# EAGLE design ursus-flow (EAGLE 7.7.0)
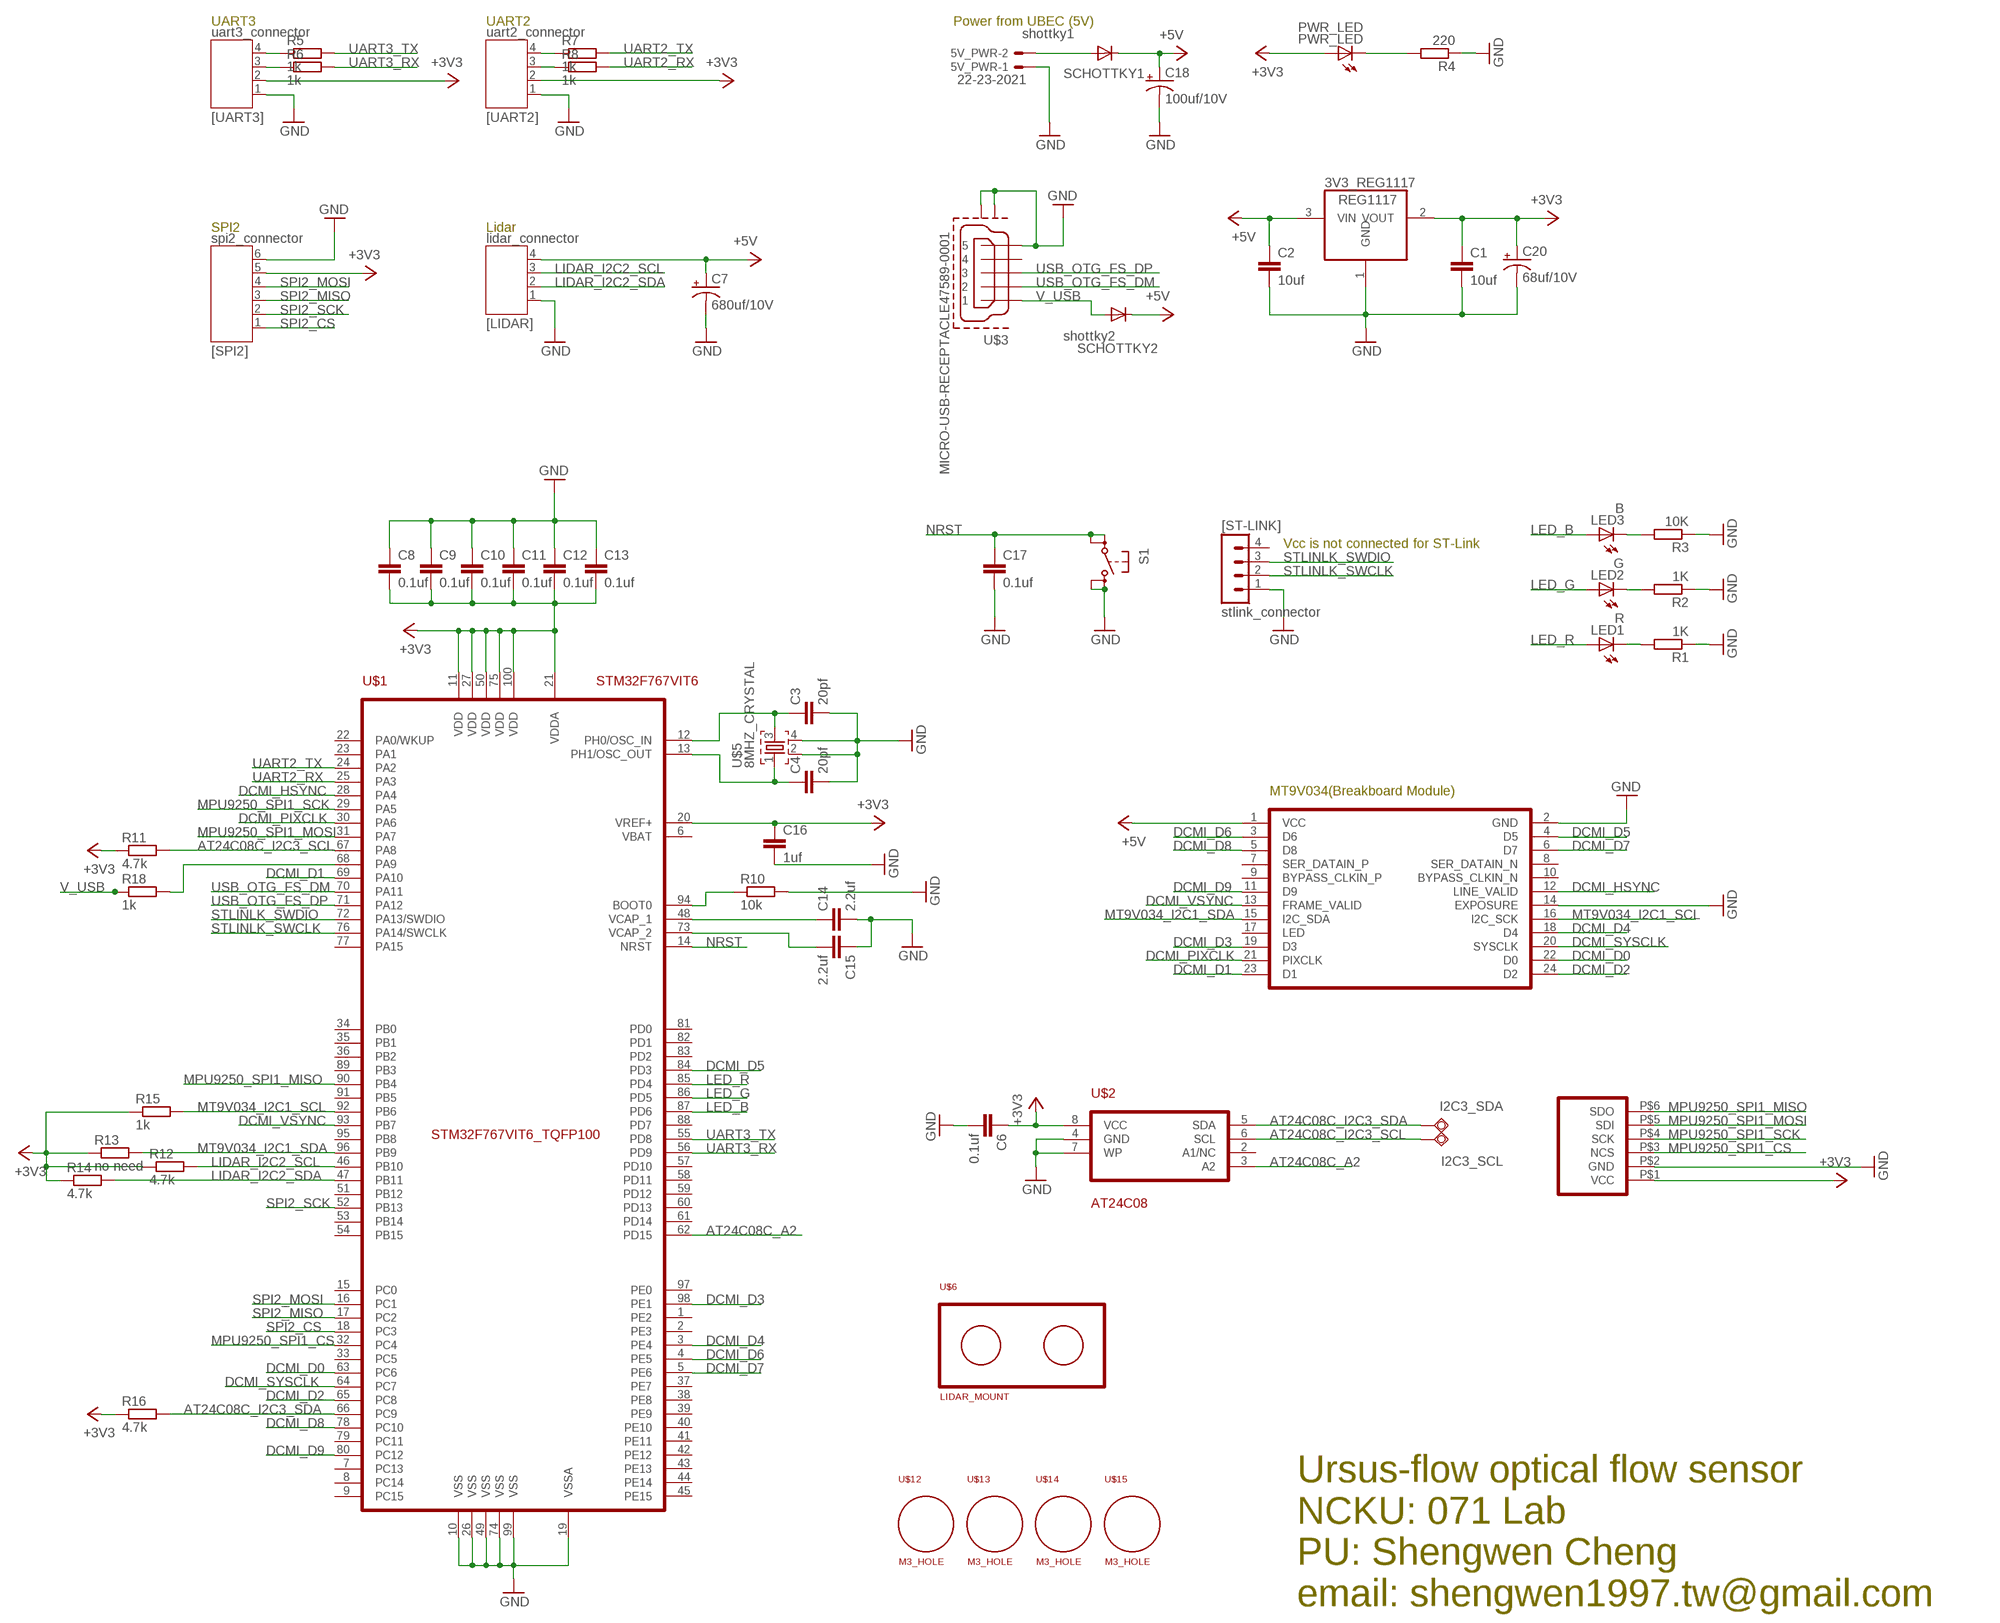
[diagram p0: schematic, sheet 1]

## Parts
3V3_REG1117  REG1117  [SOT223]
5V_PWR  22-23-2021  [22-23-2021]
[LIDAR]  lidar_connector  JST-PH4  [JST-PH4]
[SPI2]  spi2_connector  JST-PH6  [JST-PH6]
[ST-LINK]  stlink_connector  MA04-1  [MA04-1]
[UART2]  uart2_connector  JST-PH4  [JST-PH4]
[UART3]  uart3_connector  JST-PH4  [JST-PH4]
C1  10uf  C-EUC0805K  [C0805K]
C2  10uf  C-EUC0805K  [C0805K]
C3  20pf  C-EUC0805  [C0805]
C4  20pf  C-EUC0805  [C0805]
C6  0.1uf  C-EUC0805  [C0805]
C7  680uf/10V  CPOL-USD/7343-31W  [D/7343-31W]
C8  0.1uf  C-EUC0805  [C0805]
C9  0.1uf  C-EUC0805  [C0805]
C10  0.1uf  C-EUC0805  [C0805]
C11  0.1uf  C-EUC0805  [C0805]
C12  0.1uf  C-EUC0805  [C0805]
C13  0.1uf  C-EUC0805  [C0805]
C14  2.2uf  C-EUC0805  [C0805]
C15  2.2uf  C-EUC0805  [C0805]
C16  1uf  C-EUC0805  [C0805]
C17  0.1uf  C-EUC0805  [C0805]
C18  100uf/10V  CPOL-USC/6032-28R  [C/6032-28R]
C20  68uf/10V  CPOL-USB/3528-21W  [B/3528-21W]
I2C3_SCL  TPSQTP20SQ  [TP20SQ]
I2C3_SDA  TPSQTP20SQ  [TP20SQ]
LED1  R  LEDSML0805  [SML0805]
LED2  G  LEDSML0805  [SML0805]
LED3  B  LEDSML0805  [SML0805]
PWR_LED  PWR_LED  LEDSML0805  [SML0805]
R1  1K  R-EU_R0805W  [R0805W]
R2  1K  R-EU_R0805W  [R0805W]
R3  10K  R-EU_R0805W  [R0805W]
R4  220  R-EU_R0805W  [R0805W]
R5  1k  R-EU_M0805  [M0805]
R6  1k  R-EU_M0805  [M0805]
R7  1k  R-EU_M0805  [M0805]
R8  1k  R-EU_M0805  [M0805]
R10  10k  R-EU_R0805W  [R0805W]
R11  4.7k  R-EU_R0805W  [R0805W]
R12  4.7k  R-EU_R0805W  [R0805W]
R13  no need  R-EU_R0805W  [R0805W]
R14  4.7k  R-EU_R0805W  [R0805W]
R15  1k  R-EU_R0805W  [R0805W]
R16  4.7k  R-EU_R0805W  [R0805W]
R18  1k  R-EU_R0805W  [R0805W]
S1  EVQPSL/Q  [EVQPSL/Q]
SCHOTTKY1  shottky1  DIODE-SOD323-W  [SOD323-W]
SCHOTTKY2  shottky2  DIODE-SOD323-W  [SOD323-W]
U$1  STM32F767VIT6  [STM32F767VIT6]
U$2  AT24C08  [SO8]
U$3  MICRO-USB-RECEPTACLE47589-0001  [47589-0001]
U$4  MT9V034_MODULE  [MA12-2]
U$5  8MHZ_CRYSTAL  [8MHZ_CRYSTAL]
U$6  LIDAR_MOUNT  [LIDAR_MOUNT]
U$11  MPU9250_BREAKOUT  [MPU9250_BREAKOUT]
U$12  M3_HOLE  [M3_HOLE]
U$13  M3_HOLE  [M3_HOLE]
U$14  M3_HOLE  [M3_HOLE]
U$15  M3_HOLE  [M3_HOLE]

## Nets
+3V3: 3V3_REG1117.2(VOUT) [SPI2].5 [UART2].2 [UART3].2 C1.1 C6.1 C8.2 C9.2 C10.2 C11.2 C12.2 C13.2 C16.1 C20.+ PWR_LED.A R11.1 R12.1 R13.1 R14.1 R15.1 R16.1 U$1.11(VDD) U$1.20(VREF+) U$1.21(VDDA) U$1.27(VDD) U$1.50(VDD) U$1.75(VDD) U$1.100(VDD) U$2.8(VCC) U$11.P$1(VCC)
+5V: 3V3_REG1117.3(VIN) [LIDAR].4 C2.1 C7.+ C18.+ SCHOTTKY1.C SCHOTTKY2.C U$4.1(VCC)
AT24C08C_A2: U$1.62(PD15) U$2.3(A2)
AT24C08C_I2C3_SCL: I2C3_SCL.TP R11.2 U$1.67(PA8) U$2.6(SCL)
AT24C08C_I2C3_SDA: I2C3_SDA.TP R16.2 U$1.66(PC9) U$2.5(SDA)
DCMI_D0: U$1.63(PC6) U$4.22(D0)
DCMI_D1: U$1.69(PA10) U$4.23(D1)
DCMI_D2: U$1.65(PC8) U$4.24(D2)
DCMI_D3: U$1.98(PE1) U$4.19(D3)
DCMI_D4: U$1.3(PE4) U$4.18(D4)
DCMI_D5: U$1.84(PD3) U$4.4(D5)
DCMI_D6: U$1.4(PE5) U$4.3(D6)
DCMI_D7: U$1.5(PE6) U$4.6(D7)
DCMI_D8: U$1.78(PC10) U$4.5(D8)
DCMI_D9: U$1.80(PC12) U$4.11(D9)
DCMI_HSYNC: U$1.28(PA4) U$4.12(LINE_VALID)
DCMI_PIXCLK: U$1.30(PA6) U$4.21(PIXCLK)
DCMI_SYSCLK: U$1.64(PC7) U$4.20(SYSCLK)
DCMI_VSYNC: U$1.93(PB7) U$4.13(FRAME_VALID)
GND: 3V3_REG1117.1(GND) 5V_PWR.1 [LIDAR].1 [SPI2].6 [ST-LINK].1 [UART2].1 [UART3].1 C1.2 C2.2 C3.2 C4.2 C6.2 C7.- C8.1 C9.1 C10.1 C11.1 C12.1 C13.1 C14.2 C15.1 C16.2 C17.2 C18.- C20.- R1.1 R2.1 R3.1 R4.1 R10.2 S1.B1(S1) S1.B(S) U$1.10(VSS) U$1.19(VSSA) U$1.26(VSS) U$1.49(VSS) U$1.74(VSS) U$1.99(VSS) U$2.4(GND) U$2.7(WP) U$3.5 U$3.CASING1(GND1) U$3.CASING2(GND2) U$4.2(GND) U$4.14(EXPOSURE) U$5.2 U$5.4 U$11.P$2(GND)
LED_B: LED3.A U$1.87(PD6)
LED_G: LED2.A U$1.86(PD5)
LED_R: LED1.A U$1.85(PD4)
LIDAR_I2C2_SCL: [LIDAR].3 R12.2 U$1.46(PB10)
LIDAR_I2C2_SDA: [LIDAR].2 R14.2 U$1.47(PB11)
MPU9250_SPI1_CS: U$1.32(PC4) U$11.P$3(NCS)
MPU9250_SPI1_MISO: U$1.90(PB4) U$11.P$6(SDO)
MPU9250_SPI1_MOSI: U$1.31(PA7) U$11.P$5(SDI)
MPU9250_SPI1_SCK: U$1.29(PA5) U$11.P$4(SCK)
MT9V034_I2C1_SCL: R15.2 U$1.92(PB6) U$4.16(I2C_SCK)
MT9V034_I2C1_SDA: R13.2 U$1.96(PB9) U$4.15(I2C_SDA)
N$1: LED1.C R1.2
N$2: LED2.C R2.2
N$3: LED3.C R3.2
N$4: PWR_LED.C R4.2
N$6: 5V_PWR.2 SCHOTTKY1.A
N$7: C3.1 U$1.12(PH0/OSC_IN) U$5.3
N$8: [UART3].4 R5.1
N$9: [UART3].3 R6.1
N$10: [UART2].4 R7.1
N$11: [UART2].3 R8.1
N$12: C4.1 U$1.13(PH1/OSC_OUT) U$5.1
N$13: C14.1 U$1.48(VCAP_1)
N$14: C15.2 U$1.73(VCAP_2)
N$15: R10.1 U$1.94(BOOT0)
N$19: R18.2 U$1.68(PA9)
NRST: C17.1 S1.A1(P1) S1.A(P) U$1.14(NRST)
SPI2_CS: [SPI2].1 U$1.18(PC3)
SPI2_MISO: [SPI2].3 U$1.17(PC2)
SPI2_MOSI: [SPI2].4 U$1.16(PC1)
SPI2_SCK: [SPI2].2 U$1.52(PB13)
STLINLK_SWCLK: [ST-LINK].2 U$1.76(PA14/SWCLK)
STLINLK_SWDIO: [ST-LINK].3 U$1.72(PA13/SWDIO)
UART2_RX: R8.2 U$1.25(PA3)
UART2_TX: R7.2 U$1.24(PA2)
UART3_RX: R6.2 U$1.56(PD9)
UART3_TX: R5.2 U$1.55(PD8)
USB_OTG_FS_DM: U$1.70(PA11) U$3.2
USB_OTG_FS_DP: U$1.71(PA12) U$3.3
V_USB: R18.1 SCHOTTKY2.A U$3.1
Unconnected: [ST-LINK].4 U$1.1(PE2) U$1.2(PE3) U$1.6(VBAT) U$1.7(PC13) U$1.8(PC14) U$1.9(PC15) U$1.15(PC0) U$1.22(PA0/WKUP) U$1.23(PA1) U$1.33(PC5) U$1.34(PB0) U$1.35(PB1) U$1.36(PB2) U$1.37(PE7) U$1.38(PE8) U$1.39(PE9) U$1.40(PE10) U$1.41(PE11) U$1.42(PE12) U$1.43(PE13) U$1.44(PE14) U$1.45(PE15) U$1.51(PB12) U$1.53(PB14) U$1.54(PB15) U$1.57(PD10) U$1.58(PD11) U$1.59(PD12) U$1.60(PD13) U$1.61(PD14) U$1.77(PA15) U$1.79(PC11) U$1.81(PD0) U$1.82(PD1) U$1.83(PD2) U$1.88(PD7) U$1.89(PB3) U$1.91(PB5) U$1.95(PB8) U$1.97(PE0) U$2.2(A1/NC) U$3.4 U$4.7(SER_DATAIN_P) U$4.8(SER_DATAIN_N) U$4.9(BYPASS_CLKIN_P) U$4.10(BYPASS_CLKIN_N) U$4.17(LED)

## Notes on the sheet
- UART3 | UART2 | Power from UBEC (5V)
- SPI2 | Lidar
- Vcc is not connected for ST-Link
- MT9V034(Breakboard Module)
- Ursus-flow optical flow sensor
  NCKU: 071 Lab
  PU: Shengwen Cheng
  email: shengwen1997.tw@gmail.com

## Library data of the parts
3V3_REG1117 = burr-brown:REG1117: 800mA and 1A Low Dropout (LDO) Positive Regulator 1.8V, 2.5V, 2.85V, 3.3V, 5V, and Adj; MPN: REG1117; OC_FARNELL: 1097566; OC_NEWARK: 14P6981
5V_PWR = con-molex:22-23-2021: .100" (2.54mm) Center Header - 2 Pin; MF: MOLEX; MPN: 22-23-2021; OC_FARNELL: 1462926; OC_NEWARK: 25C3832
[LIDAR] [UART2] [UART3] = jst-ph:JST-PH4
[SPI2] = jst-ph:JST-PH6
[ST-LINK] = con-lstb:MA04-1: PIN HEADER; OC_FARNELL: unknown; OC_NEWARK: unknown
C1-C4 C6 C8-C17 = rcl:C-EU: CAPACITOR, European symbol
C7 C18 C20 = rcl:CPOL-US: POLARIZED CAPACITOR, American symbol
I2C3_SCL I2C3_SDA = testpad:TPSQ: Test pad
LED1-LED3 PWR_LED = led:LED: LED OSRAM: - CHIPLED LG R971, LG N971, LY N971, LG Q971, LY Q971, LO R971, LY R971 LH N974, LH R974 LS Q976, LO Q976, LY Q976 LO Q996 - Hyper CHIPLED LW Q18S LB Q993, LB Q99A, LB R99A - SideLED LS A670, LO A670, LY A670, LG A670, LP A670 LB A673, LV A673, LT A673, LW A673 LH A674 LY A675 LS A676, LA A676, LO A676, LY A676, LW A676 LS A679, LY A679, LG A679 - Hyper Micro SIDELED® LS Y876, LA Y876, LO Y876, LY Y876 LT Y87S - SmartLED LW L88C, LW L88S LB L89C, LB L89S, LG L890 LS L89K, LO L89K, LY L89K LS L896, LA L896, LO L896, LY L896 - TOPLED LS T670, LO T670, LY T670, LG T670, LP T670 LSG T670, LSP T670, LSY T670, LOP T670, LYG T670 LG T671, LOG T671, LSG T671 LB T673, LV T673, LT T673, LW T673 LH T674 LS T676, LA T676, LO T676, LY T676, LB T676, LH T676, LSB T676, LW T676 LB T67C, LV T67C, LT T67C, LS T67K, LO T67K, LY T67K, LW E67C LS E67B, LA E67B, LO E67B, LY E67B, LB E67C, LV E67C, LT E67C LW T67C LS T679, LY T679, LG T679 LS T770, LO T770, LY T770, LG T770, LP T770 LB T773, LV T773, LT T773, LW T773 LH T774 LS E675, LA E675, LY E675, LS T675 LS T776, LA T776, LO T776, LY T776, LB T776 LHGB T686 LT T68C, LB T68C - Hyper Mini TOPLED® LB M676 - Mini TOPLED Santana® LG M470 LS M47K, LO M47K, LY M47K Source: http://www.osram.convergy.de LUXEON: - LUMILED® LXK2-PW12-R00, LXK2-PW12-S00, LXK2-PW14-U00, LXK2-PW14-V00 LXK2-PM12-R00, LXK2-PM12-S00, LXK2-PM14-U00 LXK2-PE12-Q00, LXK2-PE12-R00, LXK2-PE12-S00, LXK2-PE14-T00, LXK2-PE14-U00 LXK2-PB12-K00, LXK2-PB12-L00, LXK2-PB12-M00, LXK2-PB14-N00, LXK2-PB14-P00, LXK2-PB14-Q00 LXK2-PR12-L00, LXK2-PR12-M00, LXK2-PR14-Q00, LXK2-PR14-R00 LXK2-PD12-Q00, LXK2-PD12-R00, LXK2-PD12-S00 LXK2-PH12-R00, LXK2-PH12-S00 LXK2-PL12-P00, LXK2-PL12-Q00, LXK2-PL12-R00 Source: www.luxeon.com KINGBRIGHT: KA-3528ASYC Source: www.kingbright.com
R1-R4 R10-R16 R18 = resistor:R-EU_: RESISTOR, European symbol
R5-R8 = rcl:R-EU_: RESISTOR, European symbol
S1 = switch-panasonic:EVQPS: SMD Tactile Switch
SCHOTTKY1 SCHOTTKY2 = _mod_diode:DIODE-: DIODE
U$1 = STM32F767VIT6:STM32F767VIT6
U$2 = AT24C08:AT24C08
U$3 = usb_mirco_b:MICRO-USB-RECEPTACLE: MICRO USB RECEPTACLES Micro-USB Receptacles, SMT, Lead-Free from MOLEX <http://www.molex.com/>. (C) 2014 Tomasz Boleslaw CEDRO, cederom@tlen.pl, http://www.tomek.cedro.info. Version 0.1 (2014-01-17): Initial release. Version 0.2 (2014-02-06): Updated 47589-0001 footprint pins/pads/milling. Following devices are included: 1. 47589-0001 Micro-USB AB Receptacle, Bottom Mount, SMT, Lead-Free <http://www.molex.com/molex/products/datasheet.jsp?part=active/0475890001_IO_CONNECTORS.xml> (Technical Drawing <http://www.molex.com/pdm_docs/sd/475890001_sd.pdf>).
U$4 = MT9V034_MODULE:MT9V034_MODULE
U$5 = 8MHZ_CRYSTAL:8MHZ_CRYSTAL
U$6 = LIDAR_MOUNT:LIDAR_MOUNT
U$11 = MPU9250_BREAKOUT:MPU9250_BREAKOUT
U$12-U$15 = M3_HOLE:M3_HOLE

## Board
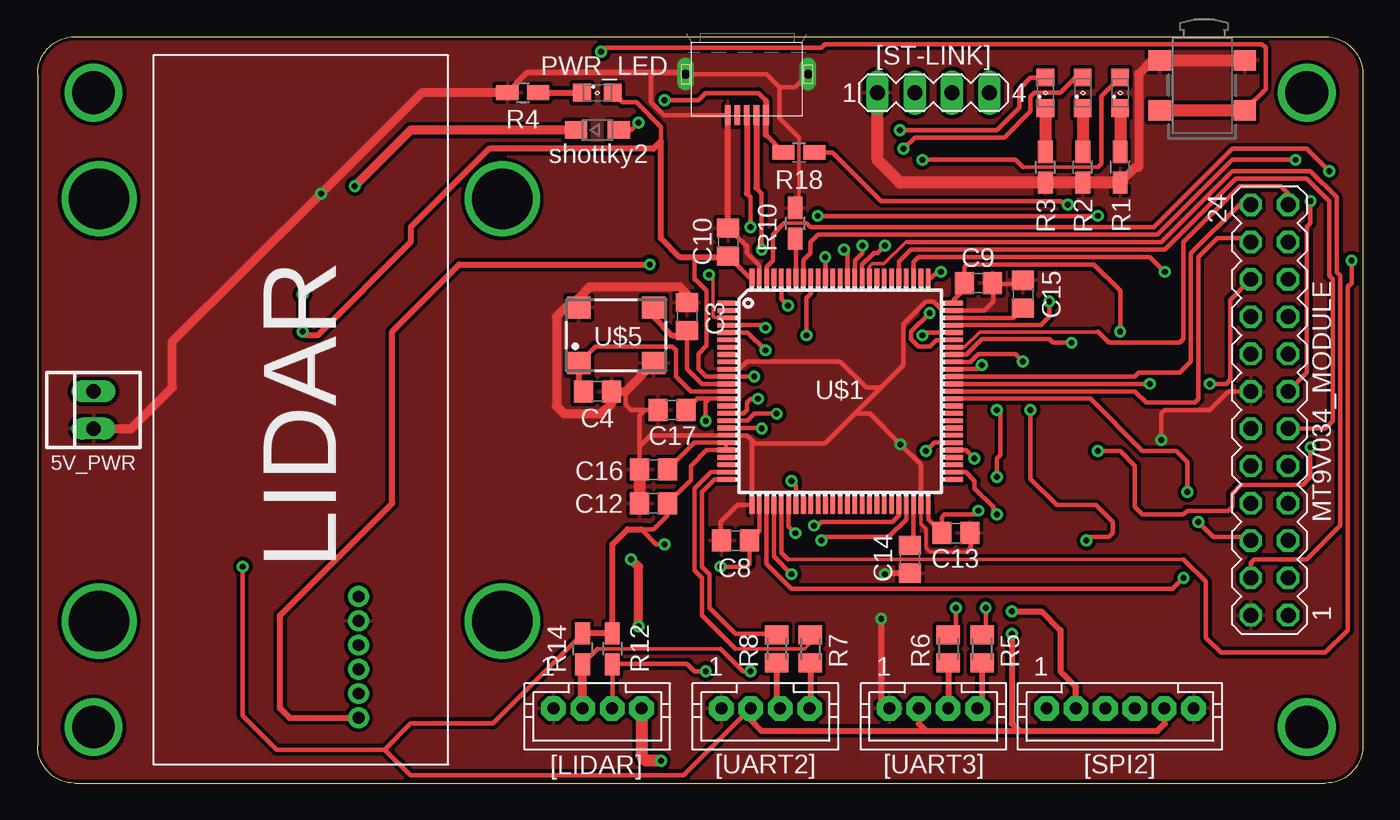
[diagram p1: board, top side]
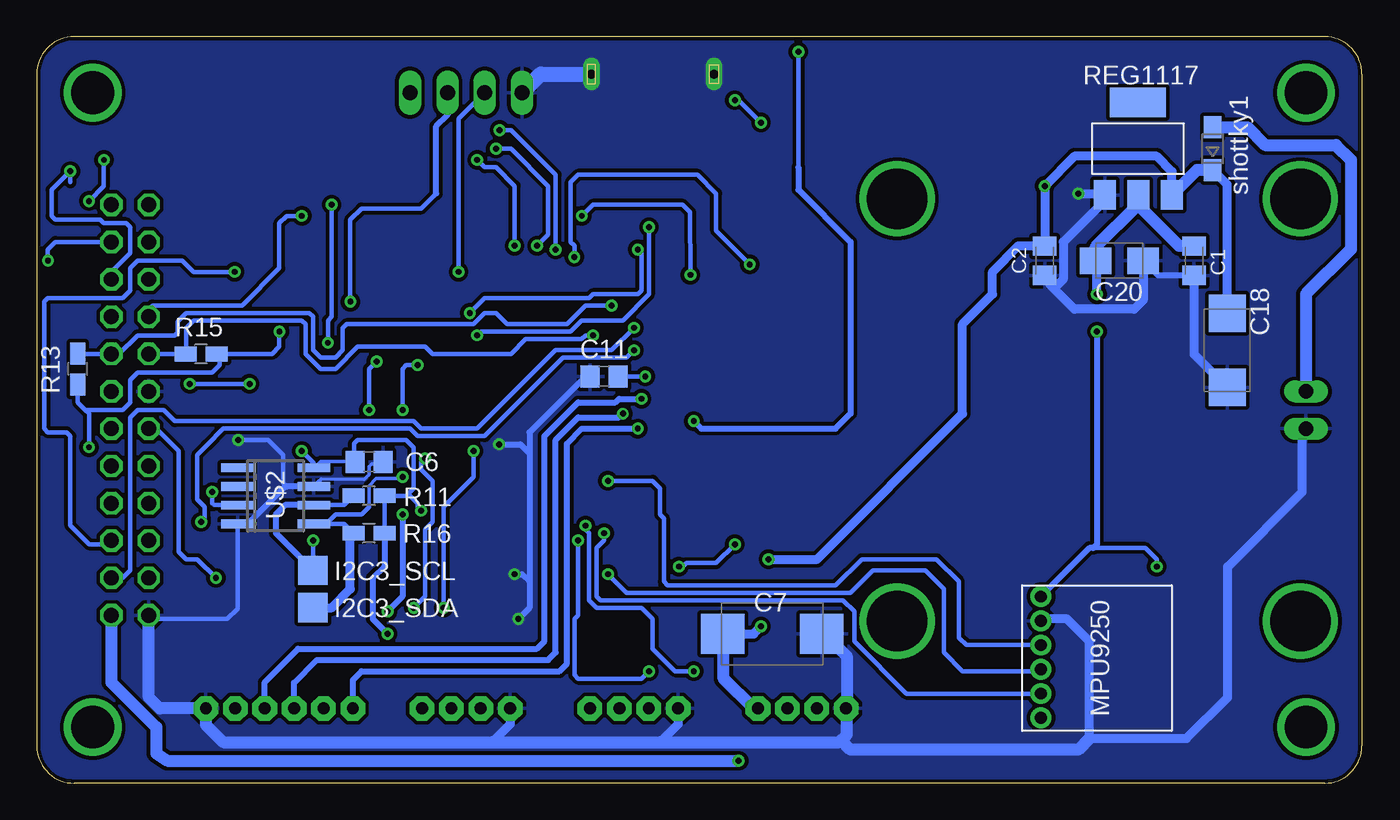
[diagram p2: board, bottom side, seen from below]

Size 90.17 x 50.8 mm. Coordinates in mm from the lower left corner, seen from the top.
Outline: 0,48.26 0,2.54 arc90 2.54,0 87.63,0 arc90 90.17,2.54 90.17,48.26 arc90 87.63,50.8 2.54,50.8 arc90 0,48.26
Copper layers (1*16): Top 0.035mm / dielectric 1.5mm / Bottom 0.035mm
Design rules "default *": minimum track width 10mil, minimum drill 11mil, track to track 6mil, track to pad 6mil, pad to pad 6mil, via to via 6mil, smd to smd 6mil, copper to edge 8mil, drill to drill 8mil, minimum pad ring 10mil, minimum via ring 8mil, stop-mask expansion 4mil, vias tented up to drill 0mil, thermal gap 10mil

### Footprints (pad centres in the part's own frame; a part is rotated, then mirrored left to right if it is on the bottom)
SOT223 = smd 1.499 x 2.007: 1 -2.261,-3.15; 2 0.025,-3.15; 3 2.311,-3.15 | smd 3.81 x 2.007: 4 0,3.15
22-23-2021 = drill 1 long: 1 -1.27,0; 2 1.27,0
JST-PH4 = drill 0.813 pad 1.676 octagon: 1 3,0; 2 1,0; 3 -1,0; 4 -3,0
JST-PH6 = drill 0.813 pad 1.676 octagon: 1 5,0; 2 3,0; 3 1,0; 4 -1,0; 5 -3,0; 6 -5,0
MA04-1 = drill 1.016 long: 1 -3.81,0; 2 -1.27,0; 3 1.27,0; 4 3.81,0
C0805K = smd 1.3 x 1.6: 1 -1,0; 2 1,0
C0805 = smd 1.3 x 1.5: 1 -0.95,0; 2 0.95,0
D/7343-31W = smd 2.95 x 2.7: + 3.375,0; - -3.375,0
C/6032-28R = smd 2.55 x 2.5: + 2.525,0; - -2.525,0
B/3528-21W = smd 2.15 x 1.8: + 1.625,0; - -1.625,0
TP20SQ = smd 2 x 2: TP 0,0
SML0805 = smd 1.2 x 1.2: A 1.05,0; C -1.05,0
R0805W = smd 1.5 x 1: 1 -1.052,0; 2 1.052,0
M0805 = smd 1.3 x 1.6: 1 -0.95,0; 2 0.95,0
EVQPSL/Q = smd 1.4 x 1.5: A -1.7,2.9; A1 -1.7,-2.9; B 1.7,2.9; B1 1.7,-2.9
SOD323-W = smd 1.5 x 1.2: A 1.45,0; C -1.45,0
STM32F767VIT6 = smd 1.2 x 0.32: 1 -7.75,6; 2 -7.75,5.5; 3 -7.75,5; 4 -7.75,4.5; 5 -7.75,4; 6 -7.75,3.5; 7 -7.75,3; 8 -7.75,2.5; 9 -7.75,2; 10 -7.75,1.5; 11 -7.75,1; 12 -7.75,0.5; 13 -7.75,0; 14 -7.75,-0.5; 15 -7.75,-1; 16 -7.75,-1.5; 17 -7.75,-2; 18 -7.75,-2.5; 19 -7.75,-3; 20 -7.75,-3.5; 21 -7.75,-4; 22 -7.75,-4.5; 23 -7.75,-5; 24 -7.75,-5.5; 25 -7.75,-6; 51 7.75,-6; 52 7.75,-5.5; 53 7.75,-5; 54 7.75,-4.5; 55 7.75,-4; 56 7.75,-3.5; 57 7.75,-3; 58 7.75,-2.5; 59 7.75,-2; 60 7.75,-1.5; 61 7.75,-1; 62 7.75,-0.5; 63 7.75,0; 64 7.75,0.5; 65 7.75,1; 66 7.75,1.5; 67 7.75,2; 68 7.75,2.5; 69 7.75,3; 70 7.75,3.5; 71 7.75,4; 72 7.75,4.5; 73 7.75,5; 74 7.75,5.5; 75 7.75,6 | smd 0.32 x 1.2: 26 -6,-7.75; 27 -5.5,-7.75; 28 -5,-7.75; 29 -4.5,-7.75; 30 -4,-7.75; 31 -3.5,-7.75; 32 -3,-7.75; 33 -2.5,-7.75; 34 -2,-7.75; 35 -1.5,-7.75; 36 -1,-7.75; 37 -0.5,-7.75; 38 0,-7.75; 39 0.5,-7.75; 40 1,-7.75; 41 1.5,-7.75; 42 2,-7.75; 43 2.5,-7.75; 44 3,-7.75; 45 3.5,-7.75; 46 4,-7.75; 47 4.5,-7.75; 48 5,-7.75; 49 5.5,-7.75; 50 6,-7.75; 76 6,7.75; 77 5.5,7.75; 78 5,7.75; 79 4.5,7.75; 80 4,7.75; 81 3.5,7.75; 82 3,7.75; 83 2.5,7.75; 84 2,7.75; 85 1.5,7.75; 86 1,7.75; 87 0.5,7.75; 88 0,7.75; 89 -0.5,7.75; 90 -1,7.75; 91 -1.5,7.75; 92 -2,7.75; 93 -2.5,7.75; 94 -3,7.75; 95 -3.5,7.75; 96 -4,7.75; 97 -4.5,7.75; 98 -5,7.75; 99 -5.5,7.75; 100 -6,7.75
SO8 = smd 0.6 x 2.2: 1 -1.905,-2.6; 2 -0.635,-2.6; 3 0.635,-2.6; 4 1.905,-2.6; 5 1.905,2.6; 6 0.635,2.6; 7 -0.635,2.6; 8 -1.905,2.6
47589-0001 = smd 1.35 x 0.4: 1 2.8,1.3; 2 2.8,0.65; 3 2.8,0; 4 2.8,-0.65; 5 2.8,-1.3 | drill 0.6 pad 0.95 long: CASING1 0,4.175; CASING2 0,-4.175
MA12-2 = drill 1.016 octagon: 1 -13.97,-1.27; 2 -13.97,1.27; 3 -11.43,-1.27; 4 -11.43,1.27; 5 -8.89,-1.27; 6 -8.89,1.27; 7 -6.35,-1.27; 8 -6.35,1.27; 9 -3.81,-1.27; 10 -3.81,1.27; 11 -1.27,-1.27; 12 -1.27,1.27; 13 1.27,-1.27; 14 1.27,1.27; 15 3.81,-1.27; 16 3.81,1.27; 17 6.35,-1.27; 18 6.35,1.27; 19 8.89,-1.27; 20 8.89,1.27; 21 11.43,-1.27; 22 11.43,1.27; 23 13.97,-1.27; 24 13.97,1.27
8MHZ_CRYSTAL = smd 1.6 x 1.5: 1 -2.55,-1.9; 2 2.55,-1.9; 3 2.55,1.9; 4 -2.55,1.9
LIDAR_MOUNT = drill 4.1: P$1 -3.683,-9.756; P$2 -3.683,-38.504; P$3 23.749,-9.756; P$4 23.749,-38.504
MPU9250_BREAKOUT = drill 0.8 pad 1.422: P$1 0,0; P$2 1.651,0; P$3 3.302,0; P$4 4.953,0; P$5 6.604,0; P$6 8.255,0
M3_HOLE = drill 2.9: P$1 0,0

### Placement (x,y rotation side)
3V3_REG1117  15.24,43.18 0 bottom
5V_PWR  3.81,25.4 90 top
[LIDAR]  38.1,5.08 180 top
[SPI2]  73.66,5.08 180 top
[ST-LINK]  60.96,46.99 0 top
[UART2]  49.53,5.08 180 top
[UART3]  60.96,5.08 180 top
C1  11.43,35.56 270 bottom
C2  21.59,35.56 270 bottom
C3  44.2,31.75 90 top
C4  38.1,26.67 0 top
C6  67.56,21.87 0 bottom
C7  40.13,10.16 180 bottom
C8  47.5,16.51 0 top
C9  64.01,34.04 180 top
C10  46.99,36.83 270 top
C11  51.56,27.69 0 bottom
C12  41.91,19.05 0 top
C13  62.48,17.02 180 top
C14  59.36,15.24 270 top
C15  67.06,33.27 270 top
C16  41.91,21.34 180 top
C17  43.18,25.4 180 top
C18  9.17,29.46 90 bottom
C20  16.51,35.56 180 bottom
I2C3_SCL  71.37,14.48 180 bottom
I2C3_SDA  71.37,11.94 180 bottom
LED1  73.66,46.99 90 top
LED2  71.12,46.99 90 top
LED3  68.58,46.99 90 top
PWR_LED  38.1,46.99 0 top
R1  73.66,41.91 90 top
R2  71.12,41.91 90 top
R3  68.58,41.91 90 top
R4  33.02,46.99 0 top
R5  64.26,9.14 90 top
R6  61.98,9.14 90 top
R7  52.58,9.14 90 top
R8  50.29,9.14 90 top
R10  51.56,38.1 90 top
R11  67.56,19.56 180 bottom
R12  39.12,9.14 270 top
R13  87.38,28.19 90 bottom
R14  37.08,9.14 270 top
R15  78.99,29.21 180 bottom
R16  67.56,17.02 180 bottom
R18  51.82,42.93 0 top
S1  79.25,47.5 90 top
SCHOTTKY1  10.16,43.18 90 bottom
SCHOTTKY2  38.1,44.45 0 top
U$1  54.61,26.67 0 top
U$2  73.91,19.56 270 bottom
U$3  48.26,48.26 270 top
U$4  83.82,25.4 90 top
U$5  39.37,30.48 0 top
U$6  27.94,1.27 180 top
U$11  21.84,12.7 270 bottom
U$12  3.81,46.99 0 top
U$13  3.81,3.81 0 top
U$14  86.36,46.99 0 top
U$15  86.36,3.81 0 top

### Tracks (layer width: path | path; a pad name or v marks a point on that pad's centre or on a via)
+3V3  (via drill 0.4)
  Top 0.305: C10.2 48.45,34.42 U$1.100 | U$1.50 60.61,17.94 C13.2 61.53,18.1 61.72,18.29 63.75,18.29 v64.01,18.54 | C16.1 44.69,23.17 U$1.20 U$1.21 45.53,22.67 44.45,21.59 44.45,20.64 C12.2 42.86,18.22 41.91,17.27 41.15,17.27 41.11,17.24 | v48.77,27.69 46.88,27.69 U$1.11 45.48,27.67 44.96,28.19 44.96,29.21 45.52,29.78 45.52,33.52 44.76,34.28 44.7,34.28 44.7,35.81 | R14.1 37.08,10.16 30.99,4.06 25.4,4.06 23.62,2.29 | 23.62,2.29 16.26,2.29 13.97,4.57 v13.97,14.73 | [UART2].2 48.51,5.08 43.94,0.53 25.4,0.53 23.62,2.29 | v72.14,22.61 73.66,22.61 74.68,21.59 74.68,18.8 75.18,18.29 77.98,18.29 78.23,18.54 81.03,18.54 81.28,18.8 81.28,19.69 81.89,20.3 86.08,20.3 86.61,20.83 v86.61,22.86 | v73.66,30.73 73.66,33.53 71.88,35.31 63.25,35.31 63.06,35.12 C9.2 62.99,33.97 62.99,33.53 62.36,32.9 U$1.75 | v46.48,14.73 48.26,14.73 48.45,14.92 C8.2 49.11,17.17 U$1.27 | v42.67,16.26 42.1,16.26 41.11,17.24 | 41.11,17.24 41.08,17.27 | 42.42,43.69 42.42,44.65 40.74,46.33 39.81,46.33 PWR_LED.A
  Top 0.406: R14.1 R12.1 39.12,16.26 40.13,17.27 41.08,17.27 | v18.03,33.27 v18.03,30.73 18.29,30.48 19.05,30.48 25.4,36.83 25.4,37.85 30.73,43.18 41.91,43.18 42.42,43.69 42.42,37.08 43.69,35.81 44.7,35.81 46.92,35.81 C10.2 | [UART3].2 59.96,4.05 60.45,3.56 | 60.45,3.56 66.8,3.56 | 66.8,3.56 76.2,3.56 76.71,4.06 76.71,5.03 [SPI2].5 | [UART2].2 48.53,4.3 49.28,3.56 60.45,3.56 | v66.29,10.16 66.29,4.06 66.8,3.56
  Bottom 0.254: 68.58,21.91 70.87,21.91 U$2.8
  Bottom 0.305: v13.97,14.73 13.97,15.24 14.73,16 18.29,16 | R16.1 R11.1 65.02,19.56 64.9,19.69 | R13.1 87.38,25.91 86.87,25.4 | 86.87,25.4 84.33,25.4 83.82,25.91 83.82,27.43 83.31,27.94 78.23,27.94 77.72,28.45 77.72,28.99 R15.1 74.17,29.21 73.66,29.72 v73.66,30.73 | 64.9,19.69 64.52,20.07 64.52,22.86 65.02,23.37 68.33,23.37 68.58,23.11 68.58,21.91 C6.1 | v64.01,18.54 64.26,18.8 64.26,19.05 64.9,19.69 | U$2.8 71.31,21.78 v72.14,22.61 | v86.61,22.86 86.61,25.15 86.87,25.4 | v46.48,14.73 46.23,14.73 45.97,14.99 43.94,14.99 v42.67,16.26 | C11.2 v48.77,27.69
  Bottom 0.406: v18.03,30.73 18.03,16.26 18.29,16 18.54,16 U$11.P$1 | R16.1 66.51,14.77 67.31,13.97 67.31,11.18 v66.29,10.16 | R15.1 78.23,29.21
  Bottom 0.61: v18.03,33.27 18.03,35.46 C20.+
  Bottom 0.813: C1.1 12.43,36.56 15.21,39.35 | C20.+ 18.14,36.48 15.27,39.35 15.21,39.35 | 3V3_REG1117.2 15.21,39.35
+5V  (via drill 0.4)
  Top 0.61: SCHOTTKY2.C 25.4,44.45 v21.59,40.64 | v40.89,10.67 40.89,14.73 v40.39,15.24
  Top 0.813: v42.42,1.52 41.4,1.52 41.15,1.78 41.15,5.03 [LIDAR].4
  Bottom 0.61: C7.+ 41.4,10.16 v40.89,10.67 | v40.39,15.24 37.08,15.24 27.18,25.15 27.18,31.24 25.15,33.27 25.15,34.8 23.37,36.58 21.61,36.58 C2.1 v21.59,40.64 19.56,42.67 13.97,42.67 12.93,41.63 3V3_REG1117.3 | C18.+ 9.17,40.74 SCHOTTKY1.C
  Bottom 0.813: SCHOTTKY1.C 11.23,41.73 3V3_REG1117.3 | [LIDAR].4 41.4,5.08 43.43,7.11 43.43,10.09 C7.+ | U$4.1 85.09,6.86 82.04,3.81 82.04,2.03 81.28,1.52 v42.42,1.52
AT24C08C_A2  (via drill 0.4)
  Top 0.305: U$1.62 71.62,26.17 75.18,22.61 77.47,22.61 78.23,21.84 v78.23,19.81
  Bottom 0.305: v78.23,19.81 78.23,19.05 78.11,18.92 U$2.3
AT24C08C_I2C3_SCL  (via drill 0.4)
  Top 0.305: U$1.67 63.47,28.67 64.01,29.21 66.55,29.21 v67.06,28.7 | v71.37,16.51 71.63,16.76 72.9,16.76 73.15,17.02 73.15,17.78 72.01,18.92 69.34,18.92 67.56,20.7 v67.56,25.4
  Bottom 0.305: U$2.6 69.25,18.92 R11.2 68.58,19.56 | v71.37,16.51 I2C3_SCL.TP | v67.56,25.4 67.56,28.19 v67.06,28.7
  Bottom 0.406: U$2.6 73.28,18.92 73.91,18.29 73.91,17.02 I2C3_SCL.TP
AT24C08C_I2C3_SDA  (via drill 0.4)
  Top 0.305: U$1.66 63.98,28.17 v64.26,28.45 | v65.28,25.4 65.53,25.15 65.53,22.35 65.28,22.1 v65.28,20.83
  Bottom 0.254: 67.56,18.8 67.56,20.24 67.08,20.73 65.38,20.73 v65.28,20.83
  Bottom 0.305: R16.2 69.25,17.65 U$2.5 70.48,17.65 69.85,18.29 68.07,18.29 67.56,18.8 | v64.26,28.45 65.02,28.45 65.28,28.19 v65.28,25.4
  Bottom 0.61: I2C3_SDA.TP 70.1,11.94 68.83,13.21 68.83,16.8 R16.2
DCMI_D0
  Top 0.305: U$4.22 82.3,37.08 80.26,37.08 78.99,35.81 78.99,26.16 78.74,25.91 75.44,25.91 74.68,26.67 U$1.63
DCMI_D1
  Top 0.254: 72.14,30.73 72.11,30.71 64.11,30.71 63.07,29.67 U$1.69
  Top 0.305: U$4.23 85.09,40.13 84.58,40.64 81.79,40.64 77.98,36.83 77.98,30.23 77.72,29.97 72.9,29.97 72.14,30.73
DCMI_D2
  Top 0.305: U$4.24 81.79,39.37 78.49,36.07 78.49,28.7 77.72,27.94 74.93,27.94 74.66,27.67 U$1.65
DCMI_D3  (via drill 0.4)
  Top 0.254: 52.32,38.1 50.8,38.1
  Top 0.305: v87.88,41.66 86.36,43.18 81.28,43.18 75.95,37.85 52.58,37.85 52.32,38.1 | U$1.98 49.61,35.13 50.04,35.56 50.04,37.34 50.8,38.1
  Bottom 0.305: 87.88,40.89 v87.88,41.66 89.15,40.39 89.15,38.61 88.9,38.35 85.85,38.35 85.6,38.1 84.07,38.1 83.82,37.85 83.82,36.07 85.09,34.8 U$4.19
DCMI_D4  (via drill 0.4)
  Top 0.254: v45.7,34.59 45.95,34.34 45.97,34.34 45.97,31.75 46.05,31.67 U$1.3
  Top 0.305: v53.09,38.61 v72.14,38.61
  Bottom 0.305: v45.7,34.59 45.72,38.86 46.23,39.37 52.32,39.37 v53.09,38.61 | v72.14,38.61 73.15,38.61 73.66,38.1 73.66,35.05 76.2,32.51 82.3,32.51 82.55,32.26 U$4.18
DCMI_D5
  Top 0.254: 59.18,36.83 59.08,36.83 57.61,35.36 56.82,35.36 56.61,35.15 U$1.84
  Top 0.305: U$4.4 82.55,14.99 82.8,15.24 86.36,15.24 88.65,17.53 88.65,34.54 88.39,34.8 88.39,39.88 86.61,41.66 81.28,41.66 76.45,36.83 59.18,36.83
DCMI_D6  (via drill 0.4)
  Top 0.305: U$1.4 49.35,31.17 v49.53,30.99
  Bottom 0.305: U$4.3 84.33,13.97 83.82,14.48 83.82,24.89 83.31,25.4 81.53,25.4 80.77,24.64 64.52,24.64 64.01,24.13 60.2,24.13 54.86,29.46 51.05,29.46 v49.53,30.99
DCMI_D7  (via drill 0.4)
  Top 0.305: U$1.5 48.32,30.67 v49.53,29.46 | v78.99,17.78 80.01,16.76 82.3,16.76 U$4.6
  Bottom 0.305: v78.99,17.78 78.74,18.03 78.74,18.8 79.25,19.3 79.25,22.35 78.74,22.86 78.61,22.99 77.47,24.13 64.77,24.13 64.26,23.62 59.69,23.62 54.36,28.96 50.04,28.96 v49.53,29.46
DCMI_D8  (via drill 0.4)
  Top 0.305: U$1.78 59.61,35.48 59.94,35.81 75.69,35.81 v76.71,34.8
  Bottom 0.305: v76.71,34.8 79.5,34.8 80.26,35.56 83.31,35.56 83.82,35.05 83.82,33.53 84.33,33.02 89.41,33.02 89.66,32.77 89.66,24.13 89.41,23.88 88.14,23.88 87.88,23.62 87.88,17.53 86.61,16.26 85.34,16.26 U$4.5
DCMI_D9
  Top 0.305: U$4.11 87.63,24.13 88.14,24.64 88.14,34.29 87.88,34.54 87.88,39.62 86.36,41.15 81.53,41.15 76.71,36.32 59.44,36.32 58.61,35.5 U$1.80
DCMI_HSYNC  (via drill 0.4)
  Top 0.305: U$1.28 49.61,14.91 51.31,13.21 77.22,13.21 v77.98,13.97
  Bottom 0.305: v77.98,13.97 79.25,15.24 80.01,15.24 80.52,15.75 80.52,22.61 82.04,24.13 U$4.12
DCMI_PIXCLK  (via drill 0.4)
  Top 0.254: 51.05,15.24 77.98,15.24
  Top 0.305: U$1.30 50.61,15.68 51.05,15.24 | 77.98,15.24 79.5,13.72 79.5,9.91 80.52,8.89 87.63,8.89 89.15,10.41 89.15,33.78 89.41,34.04 v89.41,35.56
  Bottom 0.305: v89.41,35.56 89.41,36.32 88.9,36.83 U$4.21
DCMI_SYSCLK  (via drill 0.4)
  Top 0.305: U$1.64 v75.68,27.17 v75.69,27.18 | U$4.20 81.15,32.89 81.15,27.46 80.87,27.18 v79.76,27.18
  Bottom 0.305: v75.69,27.18 v79.76,27.18
DCMI_VSYNC  (via drill 0.4)
  Top 0.305: U$4.13 86.36,27.94 86.36,37.85 86.61,38.1 v86.61,39.62 | U$1.93 52.11,35.6 52.58,36.07 52.58,36.83 53.09,37.34 76.2,37.34 81.28,42.42 v85.6,42.42
  Bottom 0.305: v85.6,42.42 85.6,40.64 v86.61,39.62
GND  (via drill 0.4)
  Top 0.254: 63.25,15.75 60.71,15.75 60.45,16 60.45,17.3 60.11,17.64 U$1.49 | 51.82,39.15 51.82,43.94
  Top 0.305: C8.1 46.48,16.58 46.48,17.78 47.62,18.92 U$1.26 48.61,23.32 | 57.4,26.92 58.93,28.45 58.93,31.24 60.45,32.77 60.96,32.77 61.56,32.17 U$1.74 64.43,32.17 65.02,32.77 65.02,33.97 | 57.4,26.92 55.63,25.15 | 55.63,25.15 53.59,23.11 48.82,23.11 48.61,23.32 | 66.99,34.29 C15.1 66.8,33.97 65.02,33.97 | U$4.14 81.03,26.67 79.76,25.4 76.71,25.4 76.45,25.15 v76.45,23.37 | 63.25,15.75 63.5,16 63.5,16.95 C13.1 | 47.06,37.78 C10.1 47.35,37.42 48.19,36.58 48.26,36.58 48.26,36.07 49.11,35.22 U$1.99 | 51.82,43.94 50.49,45.26 50.49,47.37 | U$1.10 47.73,28.17 48.26,28.7 54.61,28.7 56.39,26.92 57.4,26.92 | U$1.49 60.11,21.68 v58.72,23.06 56.64,25.15 55.63,25.15 | 40.01,26.67 40.01,25.78 40.39,25.4 41.32,25.4 | 41.32,25.4 C17.2 | 65.02,33.97 C9.1 | C16.2 40.96,22.91 | 40.96,22.91 40.96,25.04 41.32,25.4 | 40.96,22.91 41.72,23.67 U$1.19 48.26,23.67 48.61,23.32 | 50.49,47.37 49.61,48.26 U$3.CASING2 44.01,48.34 | 50.49,47.37 51.55,47.37 U$3.CASING1 | U$3.5 42.63,45.46 41.76,46.33 41.76,48.11 41.99,48.34
  Top 0.406: R10.2 51.82,39.15 | [UART3].1 57.4,5.64 v57.4,11.18 | C14.2 57.72,14.29 v57.66,14.22 | 44.01,48.34 41.99,48.34 33.31,48.34 R4.1 | U$3.5 46.96,37.81 47.35,37.42
  Top 0.61: S1.B 75.87,49.2 74.93,48.26 74.93,41.91 74.71,41.91 R1.1 | U$5.2 40.01,26.67 C4.2 39.12,26.6 39.12,25.91 38.35,25.15 35.81,25.15 35.31,25.65 35.31,31.75 36.31,32.76 36.82,32.76 U$5.4 36.83,33.02 37.59,33.78 43.69,33.78 44.2,33.27 C3.2 | R4.1 26.16,46.99 v19.3,40.13 9.17,30.05 C18.- 6.36,24.13 5V_PWR.1
  Top 0.813: R1.1 R2.1 R3.1 58.71,40.86 57.15,42.42 [ST-LINK].1 | S1.B S1.B1 | C16.2 C12.1
  Bottom 0.254: 66.61,21.78 66.61,21.73 67.4,21.73 67.56,21.56 67.56,21.01 67.89,20.68 70.81,20.7 70.93,20.57
  Bottom 0.305: U$2.4 76.51,11.88 77.22,11.18 82.3,11.18 U$4.2 | v76.45,23.37 74.42,23.37 73.41,22.35 73.41,20.45 73.15,20.19 | C6.2 66.61,21.78 | 70.93,20.57 U$2.7
  Bottom 0.406: U$2.4 75.82,17.65 73.28,20.19 73.15,20.19 U$2.7 | 52.83,27.37 53.15,27.37 56.64,23.88 56.64,22.45 | 56.64,22.45 56.64,13.72 | 56.64,13.72 56.64,11.94 v57.4,11.18 | v57.66,14.22 57.15,14.22 56.64,13.72 | v58.72,23.06 57.25,23.06 56.64,22.45 | C1.2 13.88,34.56 C20.-
  Bottom 0.61: C2.2 21.59,34.29 20.96,33.66 | 20.96,33.66 20.32,34.29 20.32,36.83 17.5,39.65 3V3_REG1117.1 17.6,40.13 v19.3,40.13 | C20.- 14.89,32.87 15.49,32.26 19.56,32.26 20.96,33.66 | 52.83,27.37 C11.1 | [UART2].1 46.53,4.02 47.75,2.79 | 5V_PWR.1 4.06,23.88 4.06,19.81 9.14,14.73 9.14,5.84 11.94,3.05 18.54,3.05 18.54,9.65 20.07,11.18 21.72,11.18 U$11.P$2 | [UART3].1 57.96,4.02 59.18,2.79 | C1.2 11.43,29.2 C18.-
  Bottom 0.813: 35.43,2.92 35.56,2.79 47.75,2.79 59.18,2.79 77.47,2.79 78.66,3.98 [SPI2].6 81.79,5.08 82.55,5.84 U$4.2 | 35.43,2.92 35.05,3.3 35.05,5.03 [LIDAR].1 35.05,5.13 35.05,8.64 36.58,10.16 C7.- | 18.54,3.05 19.3,2.29 34.8,2.29 35.43,2.92
  Bottom 1.016: [ST-LINK].1 55.88,48.26 U$3.CASING1
  pour Top (isolate 0.254): 87.88,0 0,0 0,2.54 0,15.24 0,41.91 0,50.8 90.17,50.8 90.17,0
  pour Bottom (isolate 0.254): 90.17,0 0,0 0,50.8 90.17,50.8
LED_B  (via drill 0.4)
  Top 0.305: U$1.87 55.11,36.08 v54.86,36.32 | v58.67,44.45 65.28,44.45 66.8,45.97 66.8,47.24 67.56,48.01 68.55,48.01 LED3.A
  Bottom 0.305: v54.86,36.32 54.86,41.4 57.91,44.45 v58.67,44.45
LED_G  (via drill 0.4)
  Top 0.305: LED2.A 70.65,48.04 69.6,46.99 67.82,46.99 67.56,46.74 67.56,45.72 65.79,43.94 59.69,43.94 v58.93,43.18 | v56.13,36.58 56.13,36.07 55.63,35.56 55.63,34.44 U$1.86
  Bottom 0.305: v58.93,43.18 57.91,43.18 55.37,40.64 55.37,37.34 v56.13,36.58
LED_R  (via drill 0.4)
  Top 0.254: 67.06,41.91 72.14,41.91
  Top 0.305: U$1.85 56.11,35.28 56.9,36.07 57.15,36.07 v57.66,36.58 | v60.2,42.42 66.55,42.42 67.06,41.91 | 72.14,41.91 72.39,42.16 72.39,46.77 LED1.A
  Bottom 0.305: v57.66,36.58 57.66,40.64 58.93,41.91 59.69,41.91 v60.2,42.42
LIDAR_I2C2_SCL  (via drill 0.4)
  Top 0.305: U$1.46 58.61,18.22 58.17,17.78 53.34,17.78 53.09,17.53 v52.83,17.53 | [LIDAR].3 39.12,5.1 R12.2 39.15,8.13 44.2,8.13 44.7,7.62 v45.47,7.62
  Top 0.406: R12.2 39.1,8.09
  Top 0.61: 39.1,8.07 R12.2
  Bottom 0.305: v45.47,7.62 46.74,7.62 48.26,9.14 48.26,11.18 49.02,11.94 52.07,11.94 52.58,12.45 52.58,17.02 52.83,17.27 v52.83,17.53
LIDAR_I2C2_SDA  (via drill 0.4)
  Top 0.254: 38.1,9.14 46.48,9.14
  Top 0.305: R14.2 37.08,8.13 38.1,9.14 | v48.51,7.62 48.01,7.62 46.48,9.14 | U$1.47 59.11,17.96 57.91,16.76 53.59,16.76 v53.34,16.51
  Top 0.61: [LIDAR].2 37.1,8.07 R14.2
  Bottom 0.305: v53.34,16.51 53.34,11.43 53.59,11.18 53.59,7.37 53.34,7.11 49.02,7.11 v48.51,7.62
MPU9250_SPI1_CS  (via drill 0.4)
  Top 0.305: U$1.32 51.61,20.27 v51.31,20.57
  Bottom 0.305: v51.31,20.57 48.26,20.57 47.75,20.07 47.75,18.29 47.5,18.03 47.5,13.72 47.24,13.46 35.81,13.46 34.04,15.24 28.96,15.24 27.43,13.72 27.43,9.91 26.92,9.4 U$11.P$3
MPU9250_SPI1_MISO  (via drill 0.4)
  Top 0.305: U$1.90 53.61,35.8 v53.59,35.81
  Top 0.406: v41.66,35.31 28.7,35.31 24.13,30.73 24.13,19.05 16.51,11.43 16.51,5.08 17.14,4.45 U$11.P$6
  Bottom 0.305: v53.59,35.81 53.59,36.58 53.85,36.83 53.85,40.89 53.34,41.4 45.21,41.4 43.94,40.13 43.94,37.59 v41.66,35.31
MPU9250_SPI1_MOSI  (via drill 0.4)
  Top 0.305: U$1.31 51.11,17.47 v51.56,17.02
  Bottom 0.305: v51.56,17.02 51.56,16.51 52.07,16 52.07,12.7 51.82,12.45 35.31,12.45 34.54,11.68 34.54,9.65 30.99,6.1 U$11.P$5
MPU9250_SPI1_SCK  (via drill 0.4)
  Top 0.305: U$1.29 50.11,15.42 v51.31,14.22
  Bottom 0.305: v51.31,14.22 50.04,12.95 34.8,12.95 33.27,14.48 29.72,14.48 28.45,13.21 28.45,8.89 27.18,7.62 21.97,7.62 U$11.P$4
MT9V034_I2C1_SCL  (via drill 0.4)
  Top 0.305: v52.32,30.48 52.32,33.02 52.61,33.31 U$1.92
  Bottom 0.305: U$4.16 R15.2 80.01,29.25 80.01,30.99 79.5,31.5 72.14,31.5 71.88,31.24 71.88,29.21 70.87,28.19 69.85,28.19 68.33,29.72 63.75,29.72 63.25,29.21 57.91,29.21 56.9,30.23 53.09,30.23 52.83,30.48 v52.32,30.48
MT9V034_I2C1_SDA  (via drill 0.4)
  Top 0.305: 50.8,32.77 v51.05,32.51 50.61,32.96 U$1.96
  Bottom 0.305: v51.05,32.51 52.83,32.51 54.1,31.24 58.17,31.24 58.93,32 59.69,32 60.45,31.24 69.09,31.24 69.34,30.99 69.34,29.46 69.85,28.96 70.87,28.96 71.37,29.46 71.37,31.75 71.63,32 80.01,32 80.59,31.42 80.59,30.68 80.8,30.48 83.31,30.48 84.58,29.21 U$4.15 87.59,29.21
  Bottom 0.406: 87.59,29.21 R13.2
N$1
  Top 0.813: LED1.C R1.2
N$2
  Top 0.813: LED2.C R2.2
N$3
  Top 0.813: LED3.C R3.2
N$4
  Top 0.406: R4.2 PWR_LED.C
N$6
  Bottom 0.813: SCHOTTKY1.A 7.8,44.63 6.6,43.43 1.78,43.43 0.76,42.42 0.76,36.32 3.81,33.27 5V_PWR.2
N$7
  Top 0.305: U$1.12 45.22,27.17 44.2,28.19 C3.1
  Top 0.406: U$5.3 41.92,31.74 43.18,30.48 43.88,30.48 C3.1 44.13,30.48
N$8
  Top 0.406: R5.1 64.26,5.38 [UART3].4
N$9
  Top 0.406: R6.1 61.98,5.1 [UART3].3
N$10
  Top 0.406: R7.1 52.58,5.13 [UART2].4
N$11
  Top 0.406: R8.1 50.29,5.32 [UART2].3
N$12
  Top 0.305: U$1.13 44.45,26.67 43.43,27.69 43.43,29.46 43.18,29.72 37.96,29.72 U$5.1
  Top 0.406: U$5.1 36.82,27 C4.1
N$13
  Top 0.305: U$1.48 59.61,16.36 C14.1
N$14
  Top 0.305: U$1.73 66.4,31.67 C15.2
N$15
  Top 0.305: U$1.94 51.61,37 R10.1
N$19  (via drill 0.4)
  Top 0.305: U$1.68 63.21,29.17 64.26,30.23 68.83,30.23 69.09,29.97 v70.36,29.97 | R18.2 54.1,42.93 57.4,39.62 69.6,39.62 v70.1,39.37
  Bottom 0.305: v70.1,39.37 70.1,31.75 70.36,31.5 v70.36,29.97
NRST  (via drill 0.4)
  Top 0.305: C17.1 44.9,26.17 45.72,26.17 | 45.72,26.17 U$1.14 | S1.A1 82.15,45.83 83.57,47.24 83.57,50.04 83.31,50.29 53.59,50.29 53.34,50.04 38.61,50.04 v38.35,49.78 | v45.47,24.64 45.47,25.92 45.72,26.17
  Top 0.813: S1.A S1.A1
  Bottom 0.305: v38.35,49.78 38.35,41.91
  Bottom 0.406: 38.35,41.91 38.35,40.39 34.8,36.83 34.8,25.15 35.81,24.13 44.96,24.13 v45.47,24.64
SPI2_CS  (via drill 0.4)
  Top 0.305: U$1.18 49.24,24.17
  Top 0.406: 49.24,24.17 v49.28,24.13
  Bottom 0.406: [SPI2].1 68.66,7.03 68.07,7.62 54.61,7.62 54.1,8.13 54.1,23.11 53.09,24.13 v49.28,24.13
SPI2_MISO  (via drill 0.4)
  Top 0.305: v50.29,25.15 48.77,25.15 48.29,24.67 U$1.17
  Bottom 0.406: [SPI2].3 72.66,6.84 71.12,8.38 55.37,8.38 54.86,8.89 54.86,23.37 53.34,24.89 50.55,24.89 v50.29,25.15
SPI2_MOSI  (via drill 0.4)
  Top 0.305: v49.02,26.16 48.51,26.16 48.26,25.91 48.26,25.4 48.03,25.17 U$1.16
  Bottom 0.406: [SPI2].4 74.66,6.87 72.39,9.14 56.13,9.14 55.63,9.65 55.63,23.62 53.34,25.91 50.8,25.91 50.55,26.16 v49.02,26.16
SPI2_SCK  (via drill 0.4)
  Top 0.305: U$1.52 63.16,21.17 63.75,20.57 63.75,20.07 65.02,18.8 65.02,18.54 v65.28,18.29
  Top 0.406: [SPI2].2 70.66,6.56 69.6,7.62 69.6,10.41 68.33,11.68 v66.29,11.68
  Bottom 0.406: v65.28,18.29 65.28,12.7 v66.29,11.68
STLINLK_SWCLK  (via drill 0.4)
  Top 0.305: U$1.76 60.84,34.42 61.21,34.8 v61.47,34.8
  Bottom 0.305: 59.94,46.74 [ST-LINK].2 61.47,45.21 v61.47,34.8
STLINLK_SWDIO  (via drill 0.4)
  Top 0.305: U$1.72 68.25,31.17 68.83,31.75 v68.83,32.77
  Bottom 0.305: v68.83,32.77 68.83,38.35 68.07,39.12 64.01,39.12 62.99,40.13
  Bottom 0.406: [ST-LINK].3 62.23,45.47 62.99,44.7 62.99,40.13
UART2_RX
  Top 0.305: U$1.25 46.07,20.67 45.21,19.81 45.21,14.73 45.72,14.22 45.72,11.94 47.5,10.16 50.23,10.16 R8.2
UART2_TX
  Top 0.254: 47.5,9.14 52.2,9.14 52.55,9.5 52.55,10.07 R7.2
  Top 0.305: U$1.24 45.81,21.17 44.7,20.07 44.7,14.48 45.21,13.97 45.21,11.43 47.5,9.14 | R7.2 52.58,9.65
UART3_RX  (via drill 0.4)
  Top 0.305: U$1.56 61.02,23.17 v60.45,22.61 | v62.48,11.94 62.48,10.6 R6.2
  Bottom 0.305: v60.45,22.61 60.45,20.83 62.48,18.8 v62.48,11.94
UART3_TX  (via drill 0.4)
  Top 0.305: v64.52,11.94 64.52,10.35 R5.2 | U$1.55 63.18,22.67 v63.75,22.1
  Bottom 0.305: v64.52,11.94 63.75,12.7 63.75,17.27 63.25,17.78 63.25,20.57 64.01,21.34 64.01,21.84 v63.75,22.1
USB_OTG_FS_DM  (via drill 0.4)
  Top 0.305: U$1.70 61.16,30.17 60.71,29.72 59.94,29.72 59.44,30.23 59.44,30.73 v60.71,32 | 48.91,40.5 49.28,40.13 v49.28,36.32
  Top 0.406: U$3.2 48.91,40.5
  Bottom 0.305: v60.71,32 59.69,33.02 52.58,33.02 52.32,33.27 49.28,33.27 49.02,33.53 49.02,36.07 v49.28,36.32
USB_OTG_FS_DP  (via drill 0.4)
  Top 0.305: U$1.71 60.39,30.67 v60.2,30.48 | 48.26,40.13 48.51,39.88 v48.51,37.85
  Top 0.406: U$3.3 48.26,40.13
  Bottom 0.305: v48.51,37.85 48.51,33.27 50.29,31.5 53.09,31.5 53.85,30.73 59.94,30.73 v60.2,30.48
V_USB  (via drill 0.4)
  Top 0.305: 49.56,44.13 R18.1 | SCHOTTKY2.A 40.39,44.45 v40.89,44.96 | v42.67,46.48 44.96,46.48 45.44,46.96 49.05,46.96 49.56,46.45
  Top 0.406: 49.56,44.13 U$3.1 49.56,46.45
  Bottom 0.305: v40.89,44.96 42.42,46.48 v42.67,46.48

### Text on the board
bNames: MPU9250
bTest: x | y | z | Ursus-flow | optical flow board
200bmp: /home/shengwen/eagle/ursus-flow/logos/coordinate.bmp | /home/shengwen/eagle/ursus-flow/logos/board_name.bmp